# Altium schematic sheet Control_Processing_Unit.SchDoc
size A2
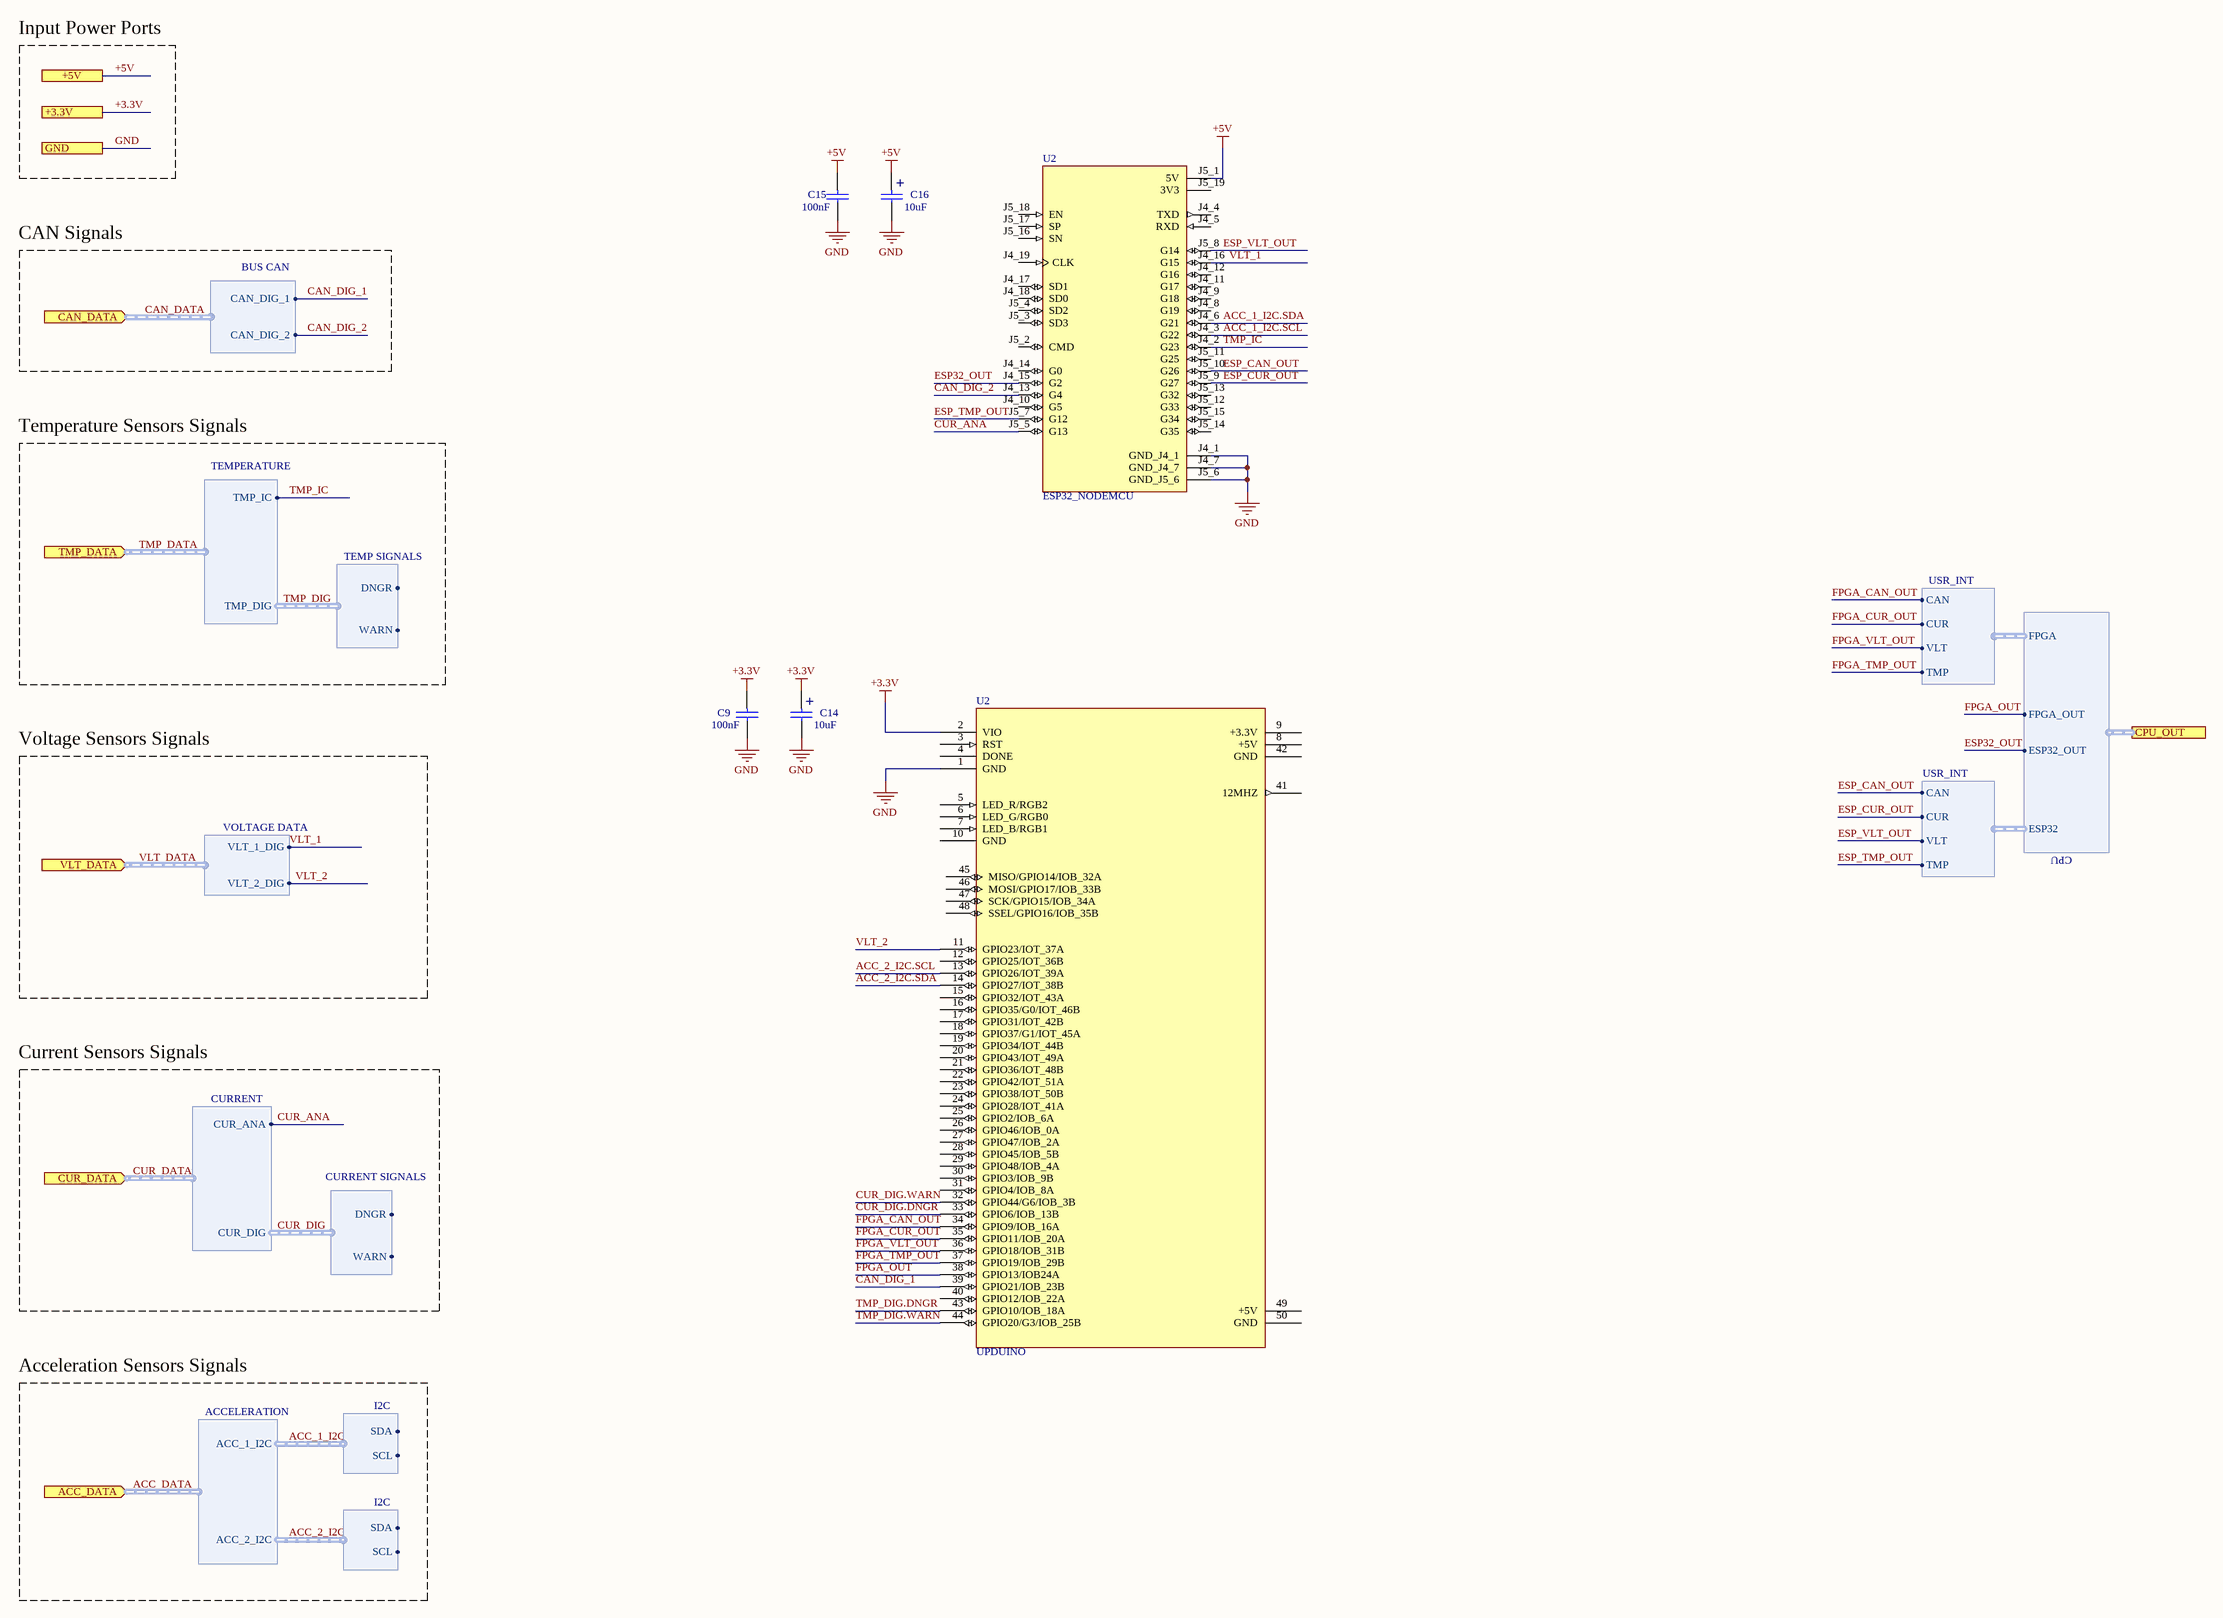
[diagram p0: Control_Processing_Unit.SchDoc]

## Parts
(Parts that share a designator on the sheet are numbered #1, #2 ... from top to bottom, then left to right.)
C9  100nF  [CAP200]
C14  10uF  [CAP100RP]
C15  100nF  [CAP200]
C16  10uF  [CAP100RP]
U2#1  ESP32_NODEMCU  [MODULE_ESP32_NODEMCU]
U2#2  UPDUINO  [UPDUINO]

## Ports
+3.3V, +5V, ACC_DATA (in, harness ACCELERATION), CAN_DATA (in, harness BUS CAN), CPU_OUT (harness CPU), CUR_DATA (in, harness CURRENT), GND, TMP_DATA (in, harness TEMPERATURE), VLT_DATA (in, harness VOLTAGE DATA)

## Harnesses
TEMPERATURE: TMP_DIG, TMP_IC
VOLTAGE DATA: VLT_2_DIG, VLT_1_DIG
CURRENT SIGNALS: WARN, DNGR
CURRENT: CUR_DIG, CUR_ANA
I2C: SCL, SDA
ACCELERATION: ACC_2_I2C, ACC_1_I2C
BUS CAN: CAN_DIG_2, CAN_DIG_1
TEMP SIGNALS: WARN, DNGR
USR_INT: CUR, VLT, TMP, CAN
CPU: FPGA, ESP32, ESP32_OUT, FPGA_OUT

## Nets
+3.3V: C9.1 C14.1 U2#2.2(VIO) ; port +3.3V
+5V: C15.1 C16.1 U2#1.J5_1(5V) ; port +5V
GND: C9.2 C14.2 C15.2 C16.2 U2#1.J4_1(GND_J4_1) U2#1.J4_7(GND_J4_7) U2#1.J5_6(GND_J5_6) U2#2.1(GND) ; port GND
ACC_1_I2C.SCL: U2#1.J4_3(G22)
ACC_1_I2C.SDA: U2#1.J4_6(G21)
ACC_2_I2C.SCL: U2#2.13(GPIO26/IOT_39A)
ACC_2_I2C.SDA: U2#2.14(GPIO27/IOT_38B)
CAN_DIG_1: U2#2.39(GPIO21/IOB_23B)
CAN_DIG_2: U2#1.J4_13(G4)
CUR_ANA: U2#1.J5_5(G13) ; port CUR_DATA.CUR_ANA
CUR_DIG.DNGR: U2#2.33(GPIO6/IOB_13B)
CUR_DIG.WARN: U2#2.32(GPIO44/G6/IOB_3B)
ESP32_OUT: U2#1.J4_15(G2)
ESP_CAN_OUT: U2#1.J5_10(G26) ; harness USR_INT.CAN
ESP_CUR_OUT: U2#1.J5_9(G27) ; harness USR_INT.CUR
ESP_TMP_OUT: U2#1.J5_7(G12) ; harness USR_INT.TMP
ESP_VLT_OUT: U2#1.J5_8(G14) ; harness USR_INT.VLT
FPGA_CAN_OUT: U2#2.34(GPIO9/IOB_16A) ; harness USR_INT.CAN
FPGA_CUR_OUT: U2#2.35(GPIO11/IOB_20A) ; harness USR_INT.CUR
FPGA_OUT: U2#2.38(GPIO13/IOB24A)
FPGA_TMP_OUT: U2#2.37(GPIO19/IOB_29B) ; harness USR_INT.TMP
FPGA_VLT_OUT: U2#2.36(GPIO18/IOB_31B) ; harness USR_INT.VLT
TMP_DIG.DNGR: U2#2.43(GPIO10/IOB_18A)
TMP_DIG.WARN: U2#2.44(GPIO20/G3/IOB_25B)
TMP_IC: U2#1.J4_2(G23) ; port TMP_DATA.TMP_IC  [project net TMP_DATA.TMP_IC]
VLT_1: U2#1.J4_16(G15) ; port VLT_DATA.VLT_1_DIG
VLT_2: U2#2.11(GPIO23/IOT_37A)

Not connected (* = marked no-connect by the designer): U2#1 J4_4(TXD) J4_5(RXD) J4_8(G19) J4_9(G18) J4_10(G5) J4_11(G17) J4_12(G16) J4_14(G0) J4_17(SD1) J4_18(SD0) J4_19(CLK) J5_2(CMD) J5_3(SD3) J5_4(SD2) J5_11(G25) J5_12(G33) J5_13(G32) J5_14(G35) J5_15(G34) J5_16(SN) J5_17(SP) J5_18(EN) J5_19(3V3); U2#2 3(RST) 4(DONE) 5(LED_R/RGB2) 6(LED_G/RGB0) 7(LED_B/RGB1) 8(+5V) 9(+3.3V) 10(GND) 12(GPIO25/IOT_36B) 15(GPIO32/IOT_43A) 16(GPIO35/G0/IOT_46B) 17(GPIO31/IOT_42B) 18(GPIO37/G1/IOT_45A) 19(GPIO34/IOT_44B) 20(GPIO43/IOT_49A) 21(GPIO36/IOT_48B) 22(GPIO42/IOT_51A) 23(GPIO38/IOT_50B) 24(GPIO28/IOT_41A) 25(GPIO2/IOB_6A) 26(GPIO46/IOB_0A) 27(GPIO47/IOB_2A) 28(GPIO45/IOB_5B) 29(GPIO48/IOB_4A) 30(GPIO3/IOB_9B) 31(GPIO4/IOB_8A) 40(GPIO12/IOB_22A) 41(12MHZ) 42(GND) 45(MISO/GPIO14/IOB_32A) 46(MOSI/GPIO17/IOB_33B) 47(SCK/GPIO15/IOB_34A) 48(SSEL/GPIO16/IOB_35B) 49(+5V) 50(GND)

## Buses and harness runs
harness ACC_DATA = port ACC_DATA
harness CAN_DATA = port CAN_DATA
harness CUR_DATA = port CUR_DATA
harness TMP_DATA = port TMP_DATA
harness VLT_DATA = port VLT_DATA

## Notes on the sheet
- Input Power Ports
- CAN Signals
- Temperature Sensors Signals
- Voltage Sensors Signals
- Current Sensors Signals
- Acceleration Sensors Signals
- (in symbol CMP-001-00092-1) +

## Library data of the parts
C9 C15 = CMP-001-00091-1: Source: Schematics.SchLib; Pins: 2; Design Item ID: CAP; Component Type: Standard
C14 C16 = CMP-001-00092-1: Source: Schematics.SchLib; Component Type: Standard; Pins: 2; Design Item ID: CAPPOL
U2#1 = CMP-027-000000-1: NodeMCU is an open source loT platform. ESP32 is a series of low cost, low powersystem-on-chip (SoC) microcontrollers with integrated Wi-Fi & dual-mode Bluetooth.; MF: Espressif Systems; MP: ESP32 NODEMCU; Package: Package; Design Item ID: ESP32_NODEMCU; Source: ESP32_NODEMCU.SchLib; Check_prices: https://www.snapeda.com/parts/ESP32%20NODEMCU/Espressif+Systems/view-part/?ref=eda; SnapEDA_Link: https://www.snapeda.com/parts/ESP32%20NODEMCU/Espressif+Systems/view-part/?ref=snap; Value: *; Pin Count: 38; Component Type: Standard
U2#2 = UPDUINO: Lattice UltraPlus ICE40UP5K FPGA with 5.3K LUTs, 1Mb SPRAM, 120Kb DPRAM, 8 Multipliers